# Altium schematic sheet BV100011_ControlMemory.SchDoc
size A4
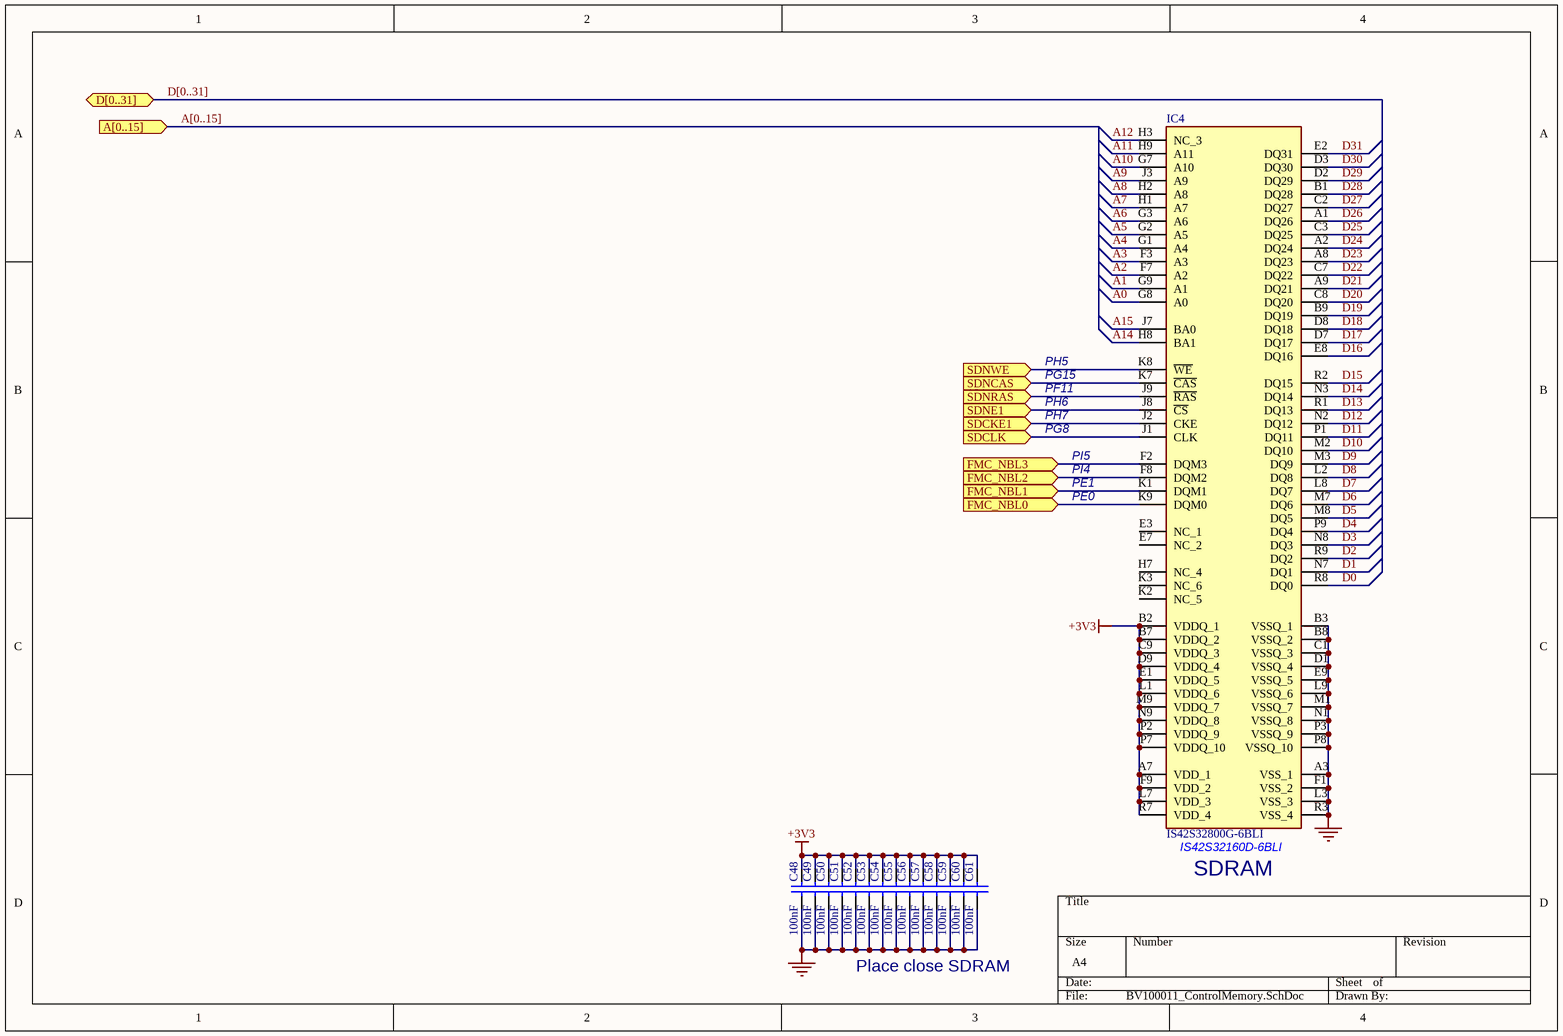
[diagram p0: BV100011_ControlMemory.SchDoc]

## Parts
C48  100nF  [C0603]
C49  100nF  [C0603]
C50  100nF  [C0603]
C51  100nF  [C0603]
C52  100nF  [C0603]
C53  100nF  [C0603]
C54  100nF  [C0603]
C55  100nF  [C0603]
C56  100nF  [C0603]
C57  100nF  [C0603]
C58  100nF  [C0603]
C59  100nF  [C0603]
C60  100nF  [C0603]
C61  100nF  [C0603]
IC4  IS42S32800G-6BLI  [BGA90C80P9X15_800X1300X120]

## Ports
A[0..15] (in), D[0..31] (bidir), FMC_NBL0 (in), FMC_NBL1 (in), FMC_NBL2 (in), FMC_NBL3 (in), SDCKE1 (in), SDCLK (in), SDNCAS (in), SDNE1 (in), SDNRAS (in), SDNWE (in)

## Nets
+3V3: C48.1 C49.1 C50.1 C51.1 C52.1 C53.1 C54.1 C55.1 C56.1 C57.1 C58.1 C59.1 C60.1 C61.1 IC4.A7(VDD_1) IC4.B2(VDDQ_1) IC4.B7(VDDQ_2) IC4.C9(VDDQ_3) IC4.D9(VDDQ_4) IC4.E1(VDDQ_5) IC4.F9(VDD_2) IC4.L1(VDDQ_6) IC4.L7(VDD_3) IC4.M9(VDDQ_7) IC4.N9(VDDQ_8) IC4.P2(VDDQ_9) IC4.P7(VDDQ_10) IC4.R7(VDD_4)
GND: C48.2 C49.2 C50.2 C51.2 C52.2 C53.2 C54.2 C55.2 C56.2 C57.2 C58.2 C59.2 C60.2 C61.2 IC4.A3(VSS_1) IC4.B3(VSSQ_1) IC4.B8(VSSQ_2) IC4.C1(VSSQ_3) IC4.D1(VSSQ_4) IC4.E9(VSSQ_5) IC4.F1(VSS_2) IC4.L3(VSS_3) IC4.L9(VSSQ_6) IC4.M1(VSSQ_7) IC4.N1(VSSQ_8) IC4.P3(VSSQ_9) IC4.P8(VSSQ_10) IC4.R3(VSS_4)
A0: IC4.G8(A0)
A1: IC4.G9(A1)
A2: IC4.F7(A2)
A3: IC4.F3(A3)
A4: IC4.G1(A4)
A5: IC4.G2(A5)
A6: IC4.G3(A6)
A7: IC4.H1(A7)
A8: IC4.H2(A8)
A9: IC4.J3(A9)
A10: IC4.G7(A10)
A11: IC4.H9(A11)
A12: IC4.H3(NC_3)
A14: IC4.H8(BA1)
A15: IC4.J7(BA0)
D0: IC4.R8(DQ0)
D1: IC4.N7(DQ1)
D2: IC4.R9(DQ2)
D3: IC4.N8(DQ3)
D4: IC4.P9(DQ4)
D5: IC4.M8(DQ5)
D6: IC4.M7(DQ6)
D7: IC4.L8(DQ7)
D8: IC4.L2(DQ8)
D9: IC4.M3(DQ9)
D10: IC4.M2(DQ10)
D11: IC4.P1(DQ11)
D12: IC4.N2(DQ12)
D13: IC4.R1(DQ13)
D14: IC4.N3(DQ14)
D15: IC4.R2(DQ15)
D16: IC4.E8(DQ16)
D17: IC4.D7(DQ17)
D18: IC4.D8(DQ18)
D19: IC4.B9(DQ19)
D20: IC4.C8(DQ20)
D21: IC4.A9(DQ21)
D22: IC4.C7(DQ22)
D23: IC4.A8(DQ23)
D24: IC4.A2(DQ24)
D25: IC4.C3(DQ25)
D26: IC4.A1(DQ26)
D27: IC4.C2(DQ27)
D28: IC4.B1(DQ28)
D29: IC4.D2(DQ29)
D30: IC4.D3(DQ30)
D31: IC4.E2(DQ31)
FMC_NBL0: IC4.K9(DQM0) ; port FMC_NBL0
FMC_NBL1: IC4.K1(DQM1) ; port FMC_NBL1
FMC_NBL2: IC4.F8(DQM2) ; port FMC_NBL2
FMC_NBL3: IC4.F2(DQM3) ; port FMC_NBL3
SDCKE1: IC4.J2(CKE) ; port SDCKE1
SDCLK: IC4.J1(CLK) ; port SDCLK
SDNCAS: IC4.K7(~{CAS}) ; port SDNCAS
SDNE1: IC4.J8(~{CS}) ; port SDNE1
SDNRAS: IC4.J9(~{RAS}) ; port SDNRAS
SDNWE: IC4.K8(~{WE}) ; port SDNWE

Not connected (* = marked no-connect by the designer): IC4 E3(NC_1) E7(NC_2) H7(NC_4) K2(NC_5) K3(NC_6)

## Buses and harness runs
bus A[0..15] = port A[0..15]
bus D[0..31] = port D[0..31]

## Notes on the sheet
- PH5
- PG15
- PF11
- PH6
- PH7
- PG8
- PE1
- PE0
- PI5
- PI4
- (near IC4) IS42S32160D-6BLI
- (near IC4) SDRAM
- Place close SDRAM

## Library data of the parts
C48-C61 = Cap: Capacitor; Value: 10nF; Published: 8-Jun-2000; Revision: July-2002: Re-released for DXP Platform.; Publisher: Altium Limited
IC4 = IS42S32800G-6BLI: Integrated Circuit; Manufacturer_Name: Integrated Silicon Solution Inc.; Datasheet Link: https://www.mouser.com/datasheet/2/198/42-45S32800G-258457.pdf; Height: 1.2mm; Manufacturer_Part_Number: IS42S32800G-6BLI; Mouser Part Number: 870-IS42S32800G-6BLI; Mouser Price/Stock: https://www.mouser.com/Search/Refine.aspx?Keyword=870-IS42S32800G-6BLI